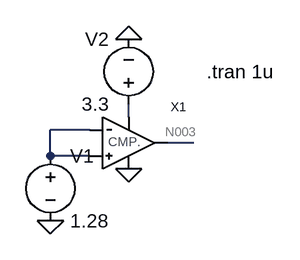
[diagram p0: schematic Draft12.asc]
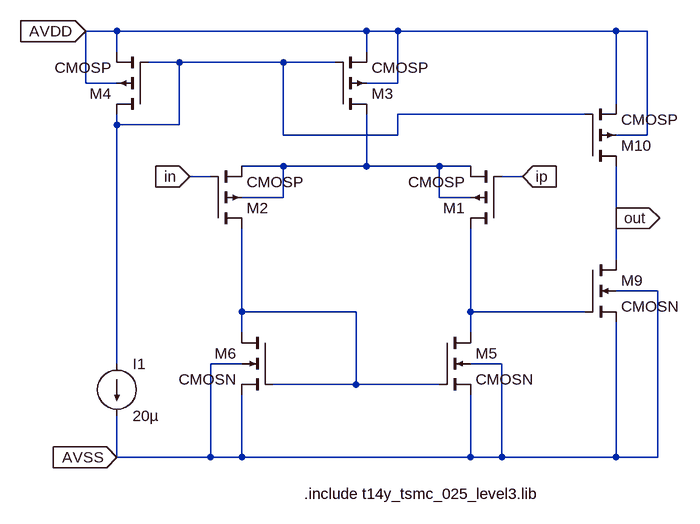
[diagram p1: sub-circuit comparator.asc]
Draft12.asc, the LTspice schematic file:
Version 4
SHEET 1 880 680
WIRE 192 112 192 96
WIRE 144 128 96 128
WIRE 272 144 240 144
WIRE 96 160 96 128
WIRE 144 160 96 160
FLAG 192 176 0
FLAG 192 16 0
FLAG 96 240 0
SYMBOL comparator 160 112 R0
SYMATTR InstName X1
SYMBOL voltage 96 144 R0
WINDOW 123 0 0 Left 0
WINDOW 39 0 0 Left 0
SYMATTR InstName V1
SYMATTR Value 1.28
SYMBOL voltage 192 112 R180
WINDOW 0 24 96 Left 2
WINDOW 3 24 16 Left 2
WINDOW 123 0 0 Left 0
WINDOW 39 0 0 Left 0
SYMATTR InstName V2
SYMATTR Value 3.3
TEXT 288 56 Left 2 !.tran 1u

comparator.asc, the sub-circuit schematic file:
Version 4
SHEET 1 3688 680
WIRE -160 -336 -208 -336
WIRE 224 -336 -160 -336
WIRE 272 -336 224 -336
WIRE 608 -336 272 -336
WIRE 656 -336 608 -336
WIRE -160 -304 -160 -336
WIRE 224 -304 224 -336
WIRE -64 -288 -112 -288
WIRE 96 -288 -64 -288
WIRE 176 -288 96 -288
WIRE -208 -256 -208 -336
WIRE -160 -256 -208 -256
WIRE 272 -256 272 -336
WIRE 272 -256 224 -256
WIRE 608 -224 608 -336
WIRE 560 -208 272 -208
WIRE -160 -192 -160 -208
WIRE -64 -192 -64 -288
WIRE -64 -192 -160 -192
WIRE 96 -176 96 -288
WIRE 272 -176 272 -208
WIRE 272 -176 96 -176
WIRE 656 -176 656 -336
WIRE 656 -176 608 -176
WIRE 96 -128 32 -128
WIRE 224 -128 224 -208
WIRE 224 -128 96 -128
WIRE 336 -128 224 -128
WIRE 384 -128 336 -128
WIRE -16 -112 -48 -112
WIRE 464 -112 432 -112
WIRE 96 -80 96 -128
WIRE 96 -80 32 -80
WIRE 336 -80 336 -128
WIRE 384 -80 336 -80
WIRE 608 -48 608 -128
WIRE 608 16 608 -48
WIRE 672 64 608 64
WIRE 32 96 32 -32
WIRE 208 96 32 96
WIRE 384 96 384 -32
WIRE 560 96 384 96
WIRE 32 128 32 96
WIRE 384 128 384 96
WIRE -160 176 -160 -192
WIRE 32 176 -16 176
WIRE 432 176 384 176
WIRE 208 208 208 96
WIRE 208 208 80 208
WIRE 336 208 208 208
WIRE -160 320 -160 256
WIRE -16 320 -16 176
WIRE -16 320 -160 320
WIRE 32 320 32 224
WIRE 32 320 -16 320
WIRE 384 320 384 224
WIRE 384 320 32 320
WIRE 432 320 432 176
WIRE 432 320 384 320
WIRE 608 320 608 112
WIRE 608 320 432 320
WIRE 672 320 672 64
WIRE 672 320 608 320
FLAG 464 -112 ip
IOPIN 464 -112 In
FLAG -48 -112 in
IOPIN -48 -112 In
FLAG 608 -48 out
IOPIN 608 -48 Out
FLAG -208 -336 AVDD
IOPIN -208 -336 In
FLAG -160 320 AVSS
IOPIN -160 320 In
SYMBOL cmosp 176 -208 M180
SYMATTR InstName M3
SYMATTR Value2 l=0.7u w=1.6u
SYMBOL cmosp -112 -208 R180
SYMATTR InstName M4
SYMATTR Value2 l=0.7u w=1.6u
SYMBOL cmosn 336 128 R0
SYMATTR InstName M5
SYMATTR Value2 l=1u w=2.7u m=1
SYMBOL cmosn 80 128 M0
SYMATTR InstName M6
SYMATTR Value2 l=1u w=2.7u m=1
SYMBOL cmosp 432 -32 R180
SYMATTR InstName M1
SYMATTR Value2 l=0.7u w=5u m=1
SYMBOL cmosp -16 -32 M180
SYMATTR InstName M2
SYMATTR Value2 l=0.7u w=5u m=1
SYMBOL cmosn 560 16 R0
SYMATTR InstName M9
SYMATTR Value2 l=0.925u w=1.225u m=1
SYMBOL cmosp 560 -128 M180
SYMATTR InstName M10
SYMATTR Value2 l=0.95u w=0.575u m=1
SYMBOL current -160 176 R0
WINDOW 123 0 0 Left 0
WINDOW 39 0 0 Left 0
SYMATTR InstName I1
SYMATTR Value 20µ
TEXT 128 376 Left 2 !.include t14y_tsmc_025_level3.lib

The netlist it stands for:
* Draft12.asc
XX1 N002 N002 N001 0 N003 comparator
V1 N002 0 1.28
V2 N001 0 3.3

* block symbol definitions
.subckt comparator in ip AVDD AVSS out
M3 N002 N001 AVDD AVDD CMOSP l=0.7u w=1.6u
M4 N001 N001 AVDD AVDD CMOSP l=0.7u w=1.6u
M5 N004 N003 AVSS AVSS CMOSN l=1u w=2.7u m=1
M6 N003 N003 AVSS AVSS CMOSN l=1u w=2.7u m=1
M1 N004 ip N002 N002 CMOSP l=0.7u w=5u m=1
M2 N003 in N002 N002 CMOSP l=0.7u w=5u m=1
M9 out N004 AVSS AVSS CMOSN l=0.925u w=1.225u m=1
M10 out N001 AVDD AVDD CMOSP l=0.95u w=0.575u m=1
I1 N001 AVSS 20µ
.include t14y_tsmc_025_level3.lib
.ends comparator

.model NMOS NMOS
.model PMOS PMOS
.lib standard.mos
.tran 1u
.backanno
.end

* Results of the author's LTspice run, read from the files saved beside the schematic
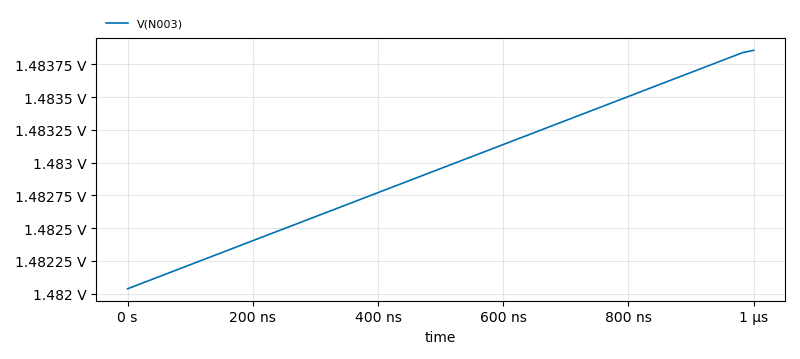
[diagram p2: Transient Analysis of Draft12.asc, plotted from the saved traces]
* Transient Analysis, 1 run:
*   V(N003): min 1.482 V, max 1.484 V, average 1.483 V, rms 1.483 V, last 1.484 V